# EAGLE schematic GearIndicator (EAGLE 6.6.0)
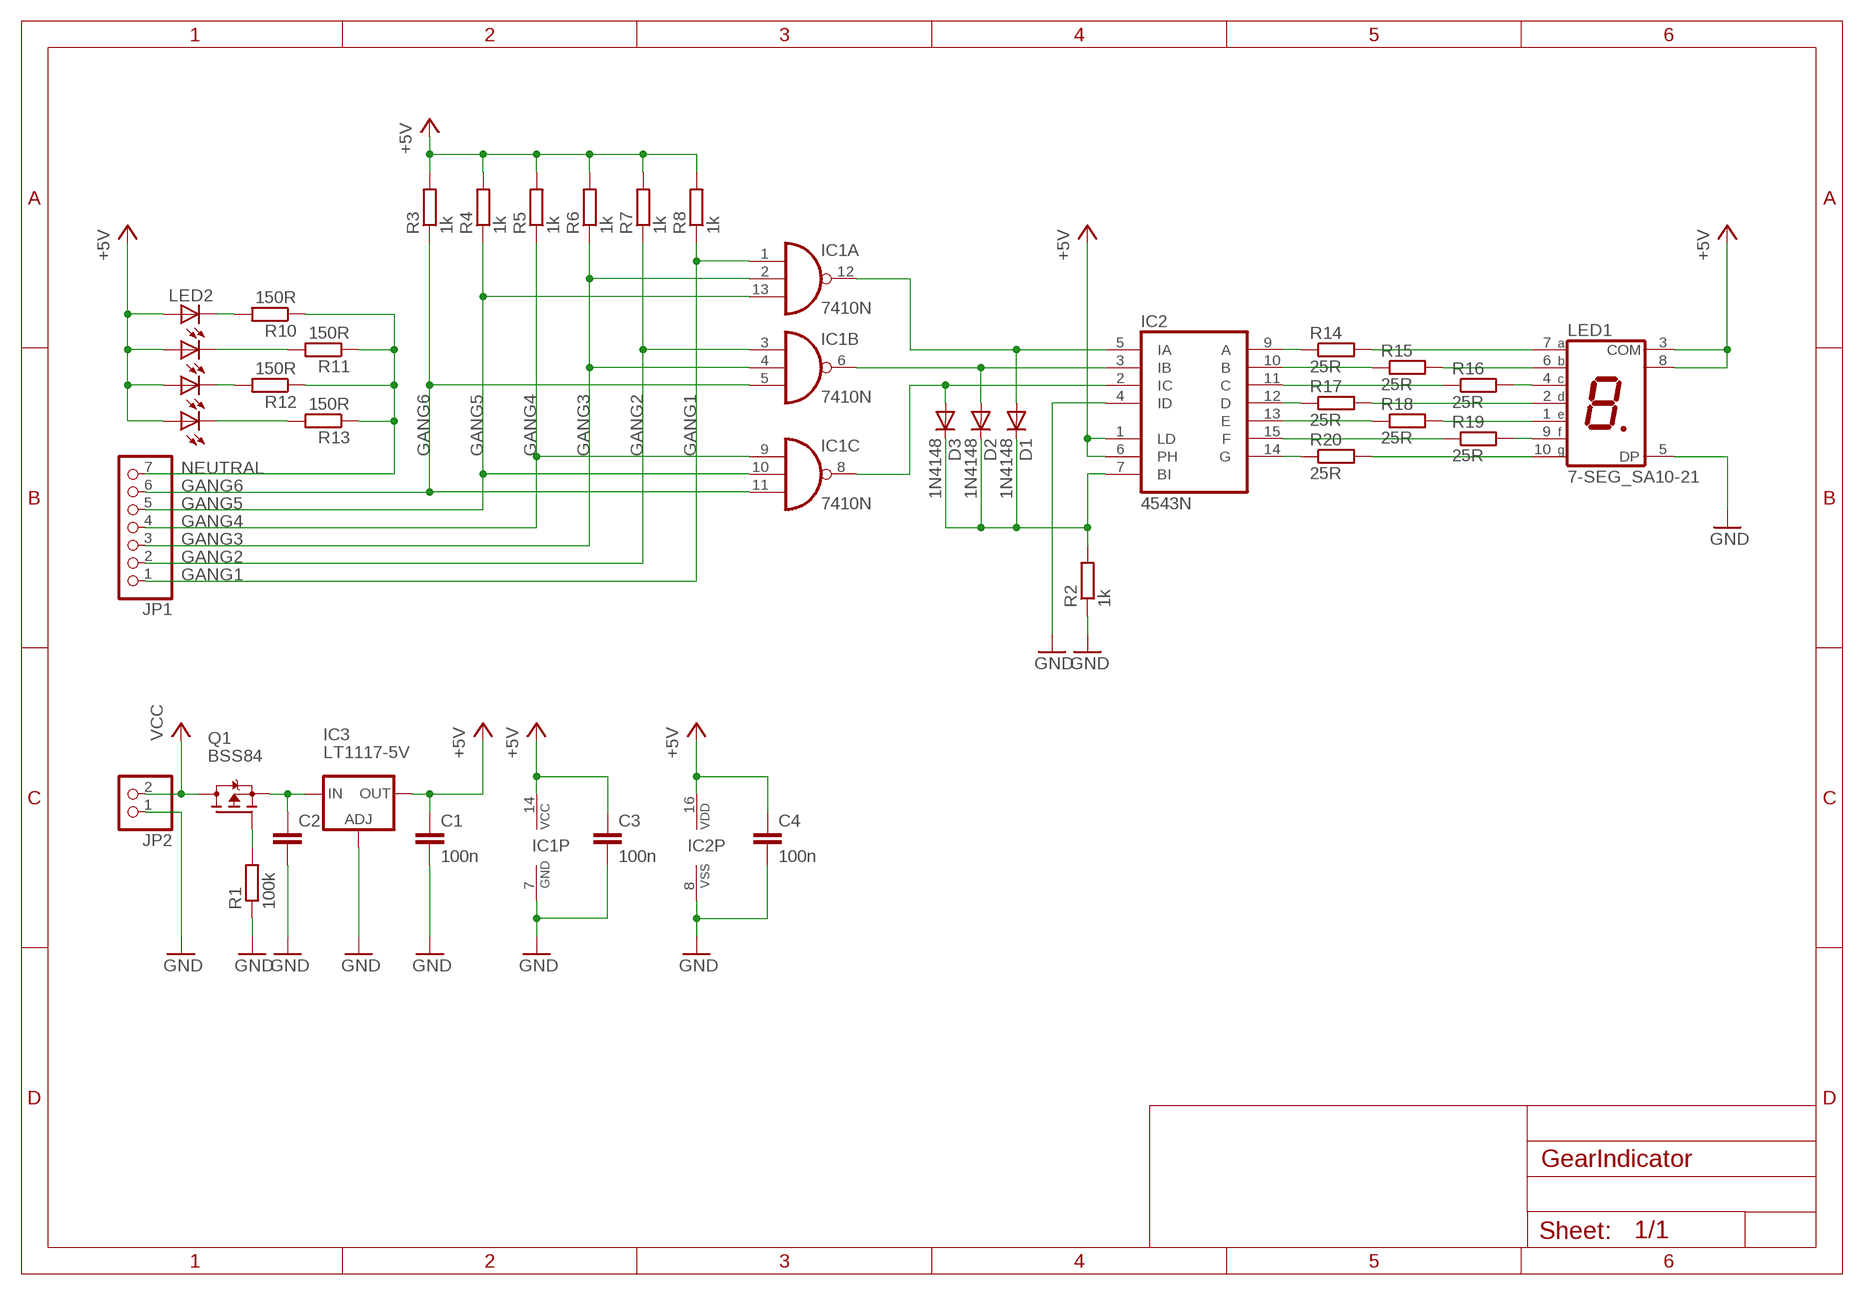
[diagram p0: schematic, sheet 1]

## Parts
C1  100n  C-EUC0603  [C0603]
C2  C-EUC1206  [C1206]
C3  100n  C-EUC0603  [C0603]
C4  100n  C-EUC0603  [C0603]
D1  1N4148  DIODE-SOD80C  [SOD80C]
D2  1N4148  DIODE-SOD80C  [SOD80C]
D3  1N4148  DIODE-SOD80C  [SOD80C]
IC1  7410N  [DIL14]
IC2  4543N  [DIL16]
IC3  LT1117-5V  LM317MSTT3  [SOT223]
JP1  PINHD-1X7/90  [1X07/90]
JP2  PINHD-1X2/90  [1X02/90]
LED1  7-SEG_SA10-21  [SA10-21]
LED2  KB-2755  [KB2755]
Q1  BSS84  BSA223SP  [SC75_INFINEON]
R1  100k  R-EU_R0603  [R0603]
R2  1k  R-EU_R0603  [R0603]
R3  1k  R-EU_R0603  [R0603]
R4  1k  R-EU_R0603  [R0603]
R5  1k  R-EU_R0603  [R0603]
R6  1k  R-EU_R0603  [R0603]
R7  1k  R-EU_R0603  [R0603]
R8  1k  R-EU_R0603  [R0603]
R10  150R  R-EU_R0603  [R0603]
R11  150R  R-EU_R0603  [R0603]
R12  150R  R-EU_R0603  [R0603]
R13  150R  R-EU_R0603  [R0603]
R14  25R  R-EU_R0603  [R0603]
R15  25R  R-EU_R0603  [R0603]
R16  25R  R-EU_R0603  [R0603]
R17  25R  R-EU_R0603  [R0603]
R18  25R  R-EU_R0603  [R0603]
R19  25R  R-EU_R0603  [R0603]
R20  25R  R-EU_R0603  [R0603]

## Nets
+5V: C1.1 C3.1 C4.1 IC1.14(P:VCC) IC2.1(LD) IC2.6(PH) IC2.16(VDD) IC3.4(OUT) LED1.3(COM) LED1.8(COM) LED2.2 LED2.3 LED2.6 LED2.7 R3.2 R4.2 R5.2 R6.2 R7.2 R8.2
GANG1: IC1.1(A:I0) JP1.1 R8.1
GANG2: IC1.3(B:I0) JP1.2 R7.1
GANG3: IC1.2(A:I1) IC1.4(B:I1) JP1.3 R6.1
GANG4: JP1.4 R5.1
GANG5: IC1.10(C:I1) IC1.13(A:I2) JP1.5 R4.1
GANG6: IC1.5(B:I2) IC1.11(C:I2) JP1.6 R3.1
GND: C1.2 C2.2 C3.2 C4.2 IC1.7(P:GND) IC2.4(ID) IC2.8(VSS) IC3.1(ADJ) JP2.1 LED1.5(DP) R1.1 R2.1
N$1: LED2.8 R10.2
N$2: LED2.4 R12.2
N$3: LED2.1 R13.2
N$4: LED2.5 R11.2
N$5: IC2.9(A) R14.1
N$6: IC2.12(D) R17.1
N$7: IC2.14(G) R20.1
N$8: Q1.1(G) R1.2
N$9: LED1.4(C) R16.2
N$10: LED1.9(F) R19.2
N$11: LED1.7(A) R14.2
N$12: LED1.6(B) R15.2
N$13: C2.1 IC3.3(IN) Q1.3(S)
N$14: IC2.10(B) R15.1
N$15: IC2.11(C) R16.1
N$16: LED1.2(D) R17.2
N$17: LED1.1(E) R18.2
N$18: IC2.13(E) R18.1
N$19: IC2.15(F) R19.1
N$20: LED1.10(G) R20.2
N$21: D1.A IC1.12(A:O) IC2.5(IA)
N$22: D2.A IC1.6(B:O) IC2.3(IB)
N$23: D3.A IC1.8(C:O) IC2.2(IC)
N$24: IC1.9(C:I0)
N$25: D1.C D2.C D3.C IC2.7(BI) R2.2
NEUTRAL: JP1.7 R10.1 R11.1 R12.1 R13.1
VCC: JP2.2 Q1.2(D)

## Library data of the parts
C1-C4 = rcl:C-EU: CAPACITOR, European symbol
D1-D3 = diode:DIODE-: DIODE
IC1 = 74xx-eu:74*10: Triple 3-input NAND gate
IC2 = 45xx:4543: BCD to 7-segment LCD DECODER
IC3 = v-reg:LM317?*: 500 mA Adjustable Output Positive Voltage Regulator Source: http://www.onsemi.co.jp .. LM317M-D.PDF
JP1 = pinhead:PINHD-1X7: PIN HEADER
JP2 = pinhead:PINHD-1X2: PIN HEADER
LED1 = display-kingbright:7-SEG_: Kingbright 14.2mm (0.56 INCH) SINGLE DIGIT NUMERIC DUISPLAY Source: SA56-11EWA(Ver1189471036.pdf; OC_FARNELL: unknown; OC_NEWARK: unknown
LED2 = SchlegelArmin:KB-2755: Flächen-LED 4fach (L x B) 10 mm x 10 mm Kingbright KB 2755 YD http://www.produktinfo.conrad.com/datenblaetter/125000-149999/141534-da-01-en-KB2755YD_FLAECHEN_LED.pdf
Q1 = transistor-fet:BSA223SP: OptiMOS(R)-P Small-Signal-Transistor P-Channel, Enhancement mode, Super Logic Level (2.5 V rated) Source: http://www.infineon.com/upload/Document/BSA223SP_Rev1.3.pdf
R1-R8 R10-R20 = rcl:R-EU_: RESISTOR, European symbol